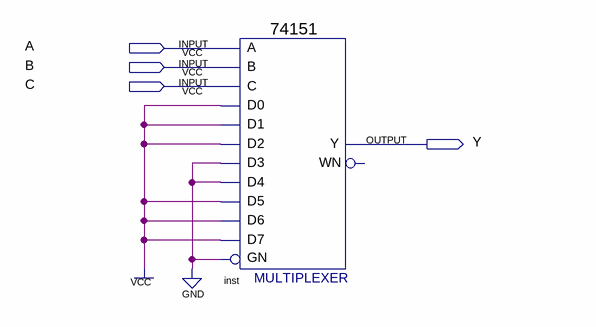
[diagram p0: schematic sheet]
// Quartus schematic Experiment41.bdf as structural Verilog: 1 symbols, 4 pins
module Experiment41 (
  input  A,
  input  B,
  input  C,
  output Y
);

  \74151  inst (
    .GN(1'b0), .C(C), .B(B), .A(A), .D5(1'b1), .D0(1'b1), .D1(1'b1), .D4(1'b0), .D3(1'b0), .D2(1'b1),
    .D6(1'b1), .D7(1'b1), .Y(Y));  // open: WN
endmodule
